# EAGLE design H0AR91 (EAGLE 9.6.2)

## Sheet 1 of 2
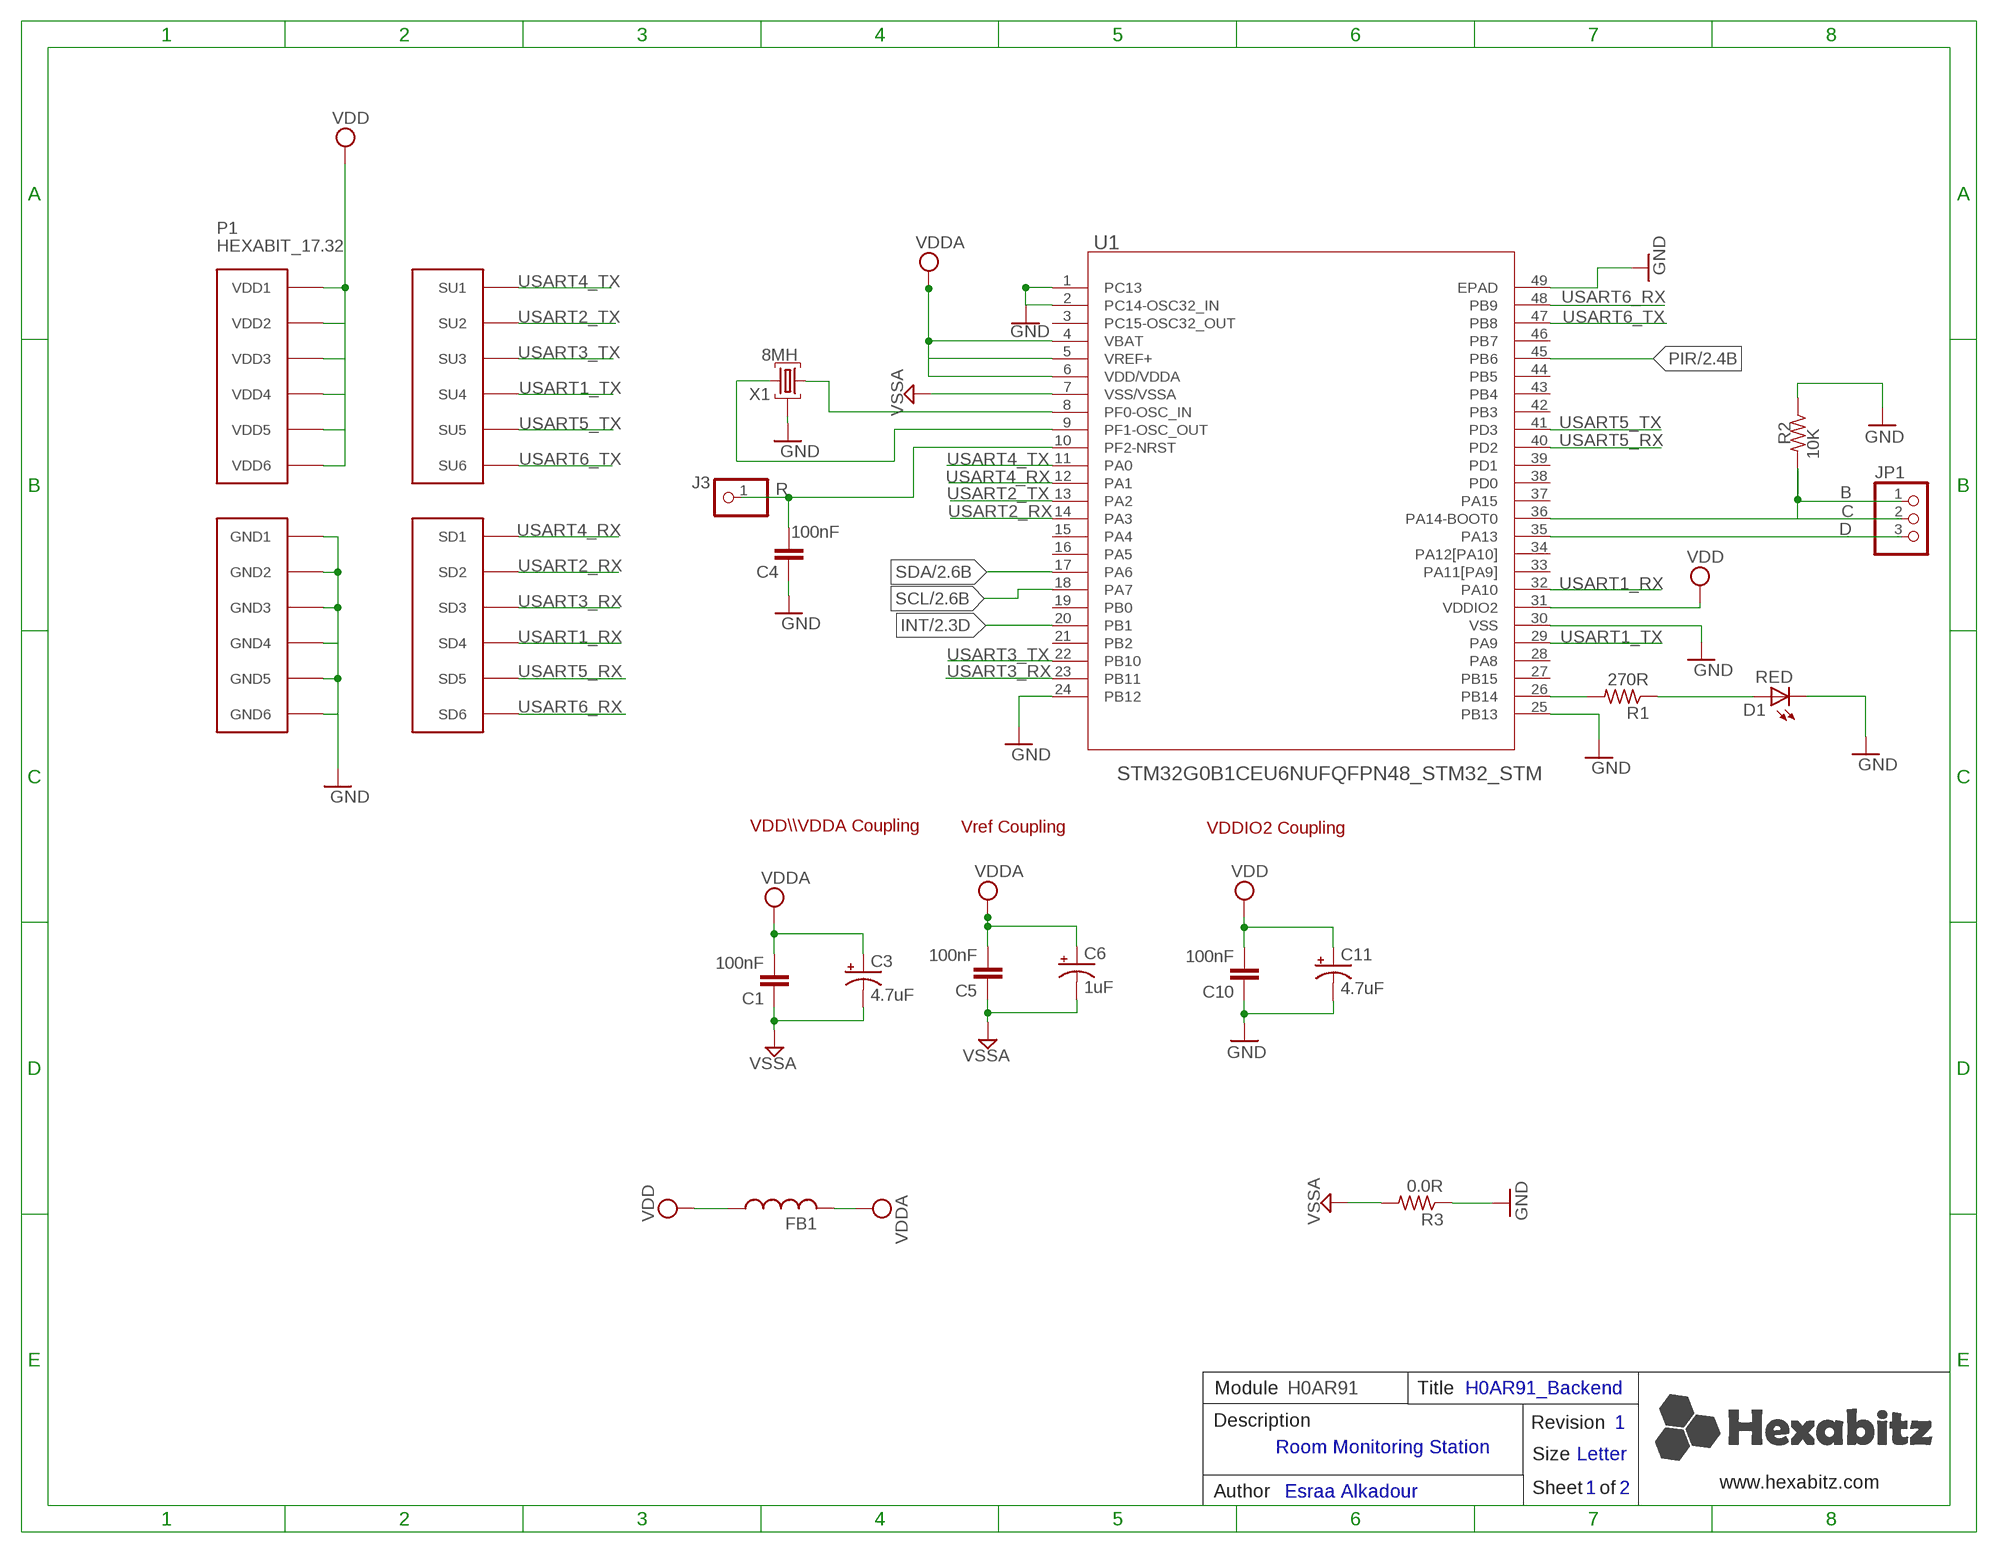
[diagram p0: schematic, sheet 1]

### Parts
C1  100nF  C-0603  [C-0603]
C3  4.7uF  C-0805-POL  [C-0805-POL]
C4  100nF  C-0603  [C-0603]
C5  100nF  C-0603  [C-0603]
C6  1uF  C-0805-POL  [C-0805-POL]
C10  100nF  C-0603  [C-0603]
C11  4.7uF  C-0805-POL  [C-0805-POL]
D1  RED  VLMS1300-GS08  [VLMS1300-GS08]
FB1  FB-TDK_MMZ1608Y300B  [FB-TDK_MMZ1608Y300B]
J3  PINHD-1X1  [1X01]
JP1  PINHD-1X3  [1X03]
P1  HEXABIT_17.32  [HEXABIT_17.32]
R1  270R  R-0603  [R-0603]
R2  10K  R-0603  [R-0603]
R3  0.0R  R-0603  [R-0603]
U1  STM32G0B1CEU6NUFQFPN48_STM32_STM  [UFQFPN48_STM32_STM]
X1  8MH  XTALL_CSTCE8M00G52  [XTALL_CSTCE8M00G52]

### Nets
C: JP1.1 JP1.2 R2.2 U1.36(PA14-BOOT0)
D: JP1.3 U1.35(PA13)
GND: C4.1 C10.1 C11.2(-) D1.C P1.PAD_PD7(GND1) P1.PAD_PD8(GND2) P1.PAD_PD9(GND3) P1.PAD_PD10(GND4) P1.PAD_PD11(GND5) P1.PAD_PD12(GND6) R2.1 R3.1 U1.1(PC13) U1.2(PC14-OSC32_IN) U1.24(PB12) U1.25(PB13) U1.30(VSS) U1.49(EPAD) X1.P$2 ; also sheet 2
GND1: C1.1 C3.2(-) C5.1 C6.2(-) R3.2 U1.7(VSS/VSSA) ; supply symbol labelled VSSA
INT: U1.20(PB1) ; also sheet 2
N$1: U1.8(PF0-OSC_IN) X1.P$3
N$2: U1.9(PF1-OSC_OUT) X1.P$1
N$17: R1.2 U1.26(PB14)
N$19: D1.A R1.1
PIR: U1.45(PB6) ; also sheet 2
R: C4.2 J3.1 U1.10(PF2-NRST)
SCL: U1.18(PA7) ; also sheet 2
SDA: U1.17(PA6) ; also sheet 2
USART1_RX: P1.PAD_PD4(SD4) U1.32(PA10)
USART1_TX: P1.PAD_PU4(SU4) U1.29(PA9)
USART2_RX: P1.PAD_PD2(SD2) U1.14(PA3)
USART2_TX: P1.PAD_PU2(SU2) U1.13(PA2)
USART3_RX: P1.PAD_PD3(SD3) U1.23(PB11)
USART3_TX: P1.PAD_PU3(SU3) U1.22(PB10)
USART4_RX: P1.PAD_PD1(SD1) U1.12(PA1)
USART4_TX: P1.PAD_PU1(SU1) U1.11(PA0)
USART5_RX: P1.PAD_PD5(SD5) U1.40(PD2)
USART5_TX: P1.PAD_PU5(SU5) U1.41(PD3)
USART6_RX: P1.PAD_PD6(SD6) U1.48(PB9)
USART6_TX: P1.PAD_PU6(SU6) U1.47(PB8)
VCC: C1.2 C3.1(+) C5.2 C6.1(+) FB1.2 U1.4(VBAT) U1.5(VREF+) U1.6(VDD/VDDA) ; supply symbol labelled VDDA
VDD: C10.2 C11.1(+) FB1.1 P1.PAD_PU7(VDD1) P1.PAD_PU8(VDD2) P1.PAD_PU9(VDD3) P1.PAD_PU10(VDD4) P1.PAD_PU11(VDD5) P1.PAD_PU12(VDD6) U1.31(VDDIO2) ; also sheet 2
Unconnected: U1.3(PC15-OSC32_OUT) U1.15(PA4) U1.16(PA5) U1.19(PB0) U1.21(PB2) U1.27(PB15) U1.28(PA8) U1.33(PA11[PA9]) U1.34(PA12[PA10]) U1.37(PA15) U1.38(PD0) U1.39(PD1) U1.42(PB3) U1.43(PB4) U1.44(PB5) U1.46(PB7)

### Notes on the sheet
- R | B
- VDD\\\VDDA Coupling | Vref Coupling | VDDIO2 Coupling
- Module | H0AR91 | Title | H0AR91_Backend
- Description | Revision | 1
- Room Monitoring Station
- Size | Letter
- www.hexabitz.com
- Author | Esraa Alkadour | Sheet   of | 1 | 2
- C:/Users/Admin/Desktop/logodraft.bmp

## Sheet 2 of 2
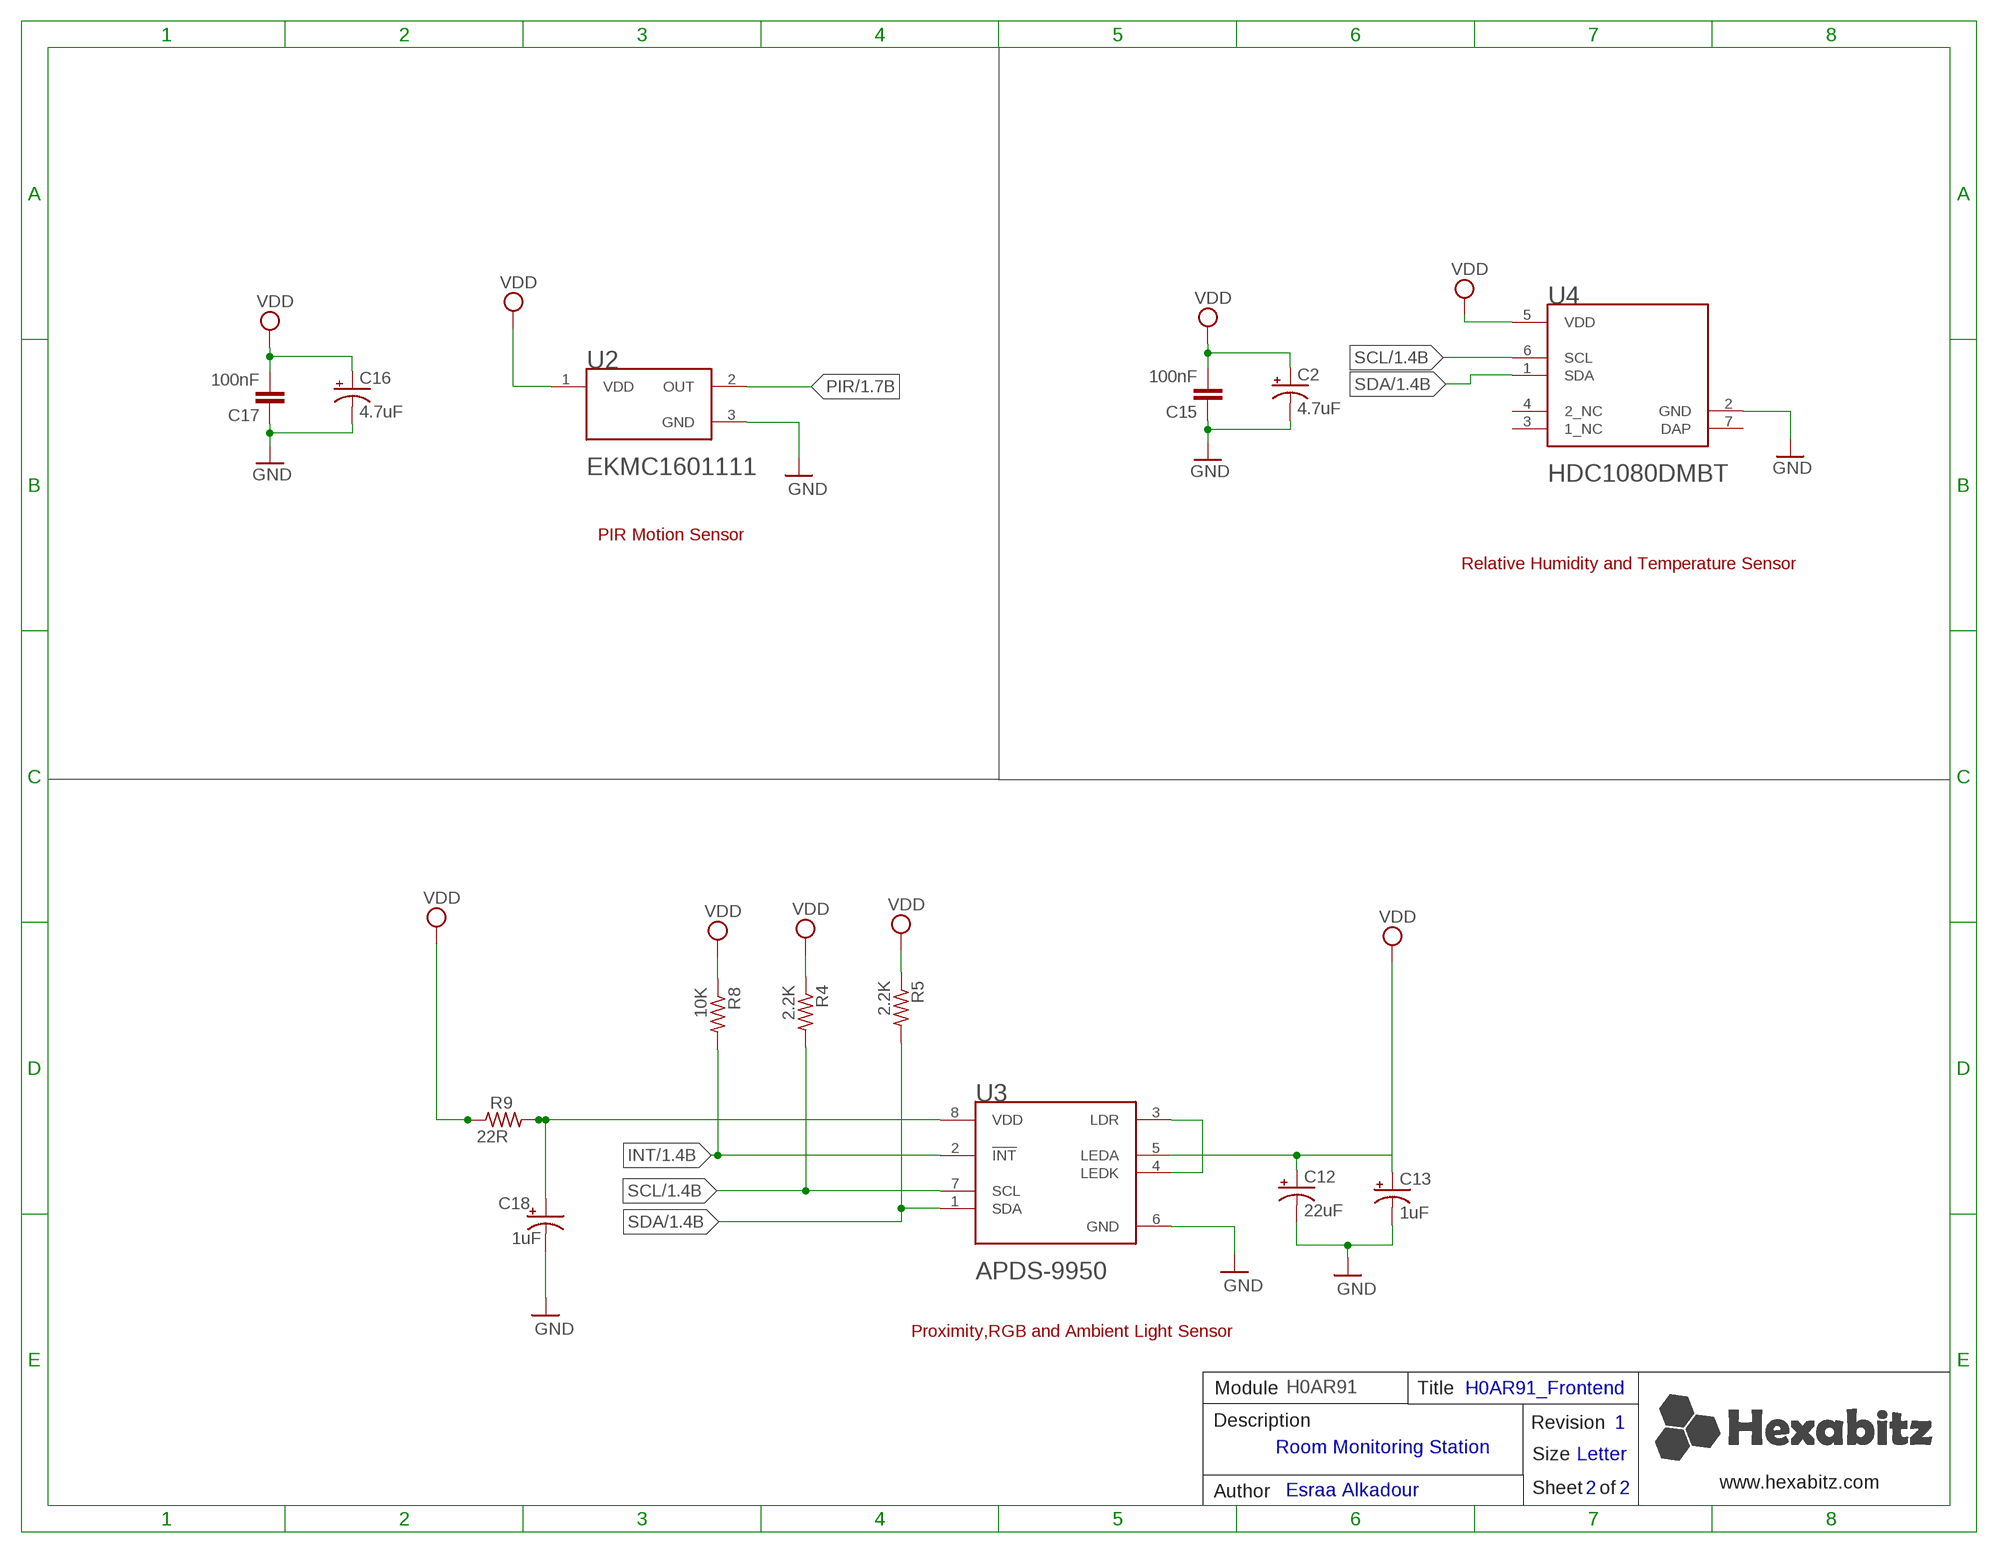
[diagram p1: schematic, sheet 2]

### Parts
C2  4.7uF  C-0805-POL  [C-0805-POL]
C12  22uF  C-0805-POL  [C-0805-POL]
C13  1uF  C-0805-POL  [C-0805-POL]
C15  100nF  C-0603  [C-0603]
C16  4.7uF  C-0805-POL  [C-0805-POL]
C17  100nF  C-0603  [C-0603]
C18  1uF  C-0805-POL  [C-0805-POL]
R4  2.2K  R-0603  [R-0603]
R5  2.2K  R-0603  [R-0603]
R8  10K  R-0603  [R-0603]
R9  22R  R-US_R1210  [R1210]
U2  PANASONIC_EKMC1601111PANASONIC_EKMC1601111_0_0  [PANASONIC_EKMC1601111_0]
U3  BROADCOM_APDS-9950BROADCOM_APDS-9950_0_0  BROADCOM_APDS-9960BROADCOM_APDS-9960_0_0  [BROADCOM_APDS-9960_0]
U4  TEXAS_INSTRUMENTS_HDC1080DMBT1TEXAS_INSTRUMENTS_HDC1080DMBT_0_1  [TEXAS_INSTRUMENTS_HDC1080DMBT_1]

### Nets
GND: C2.2(-) C12.2(-) C13.2(-) C15.1 C16.2(-) C17.1 C18.2(-) U2.3(GND) U3.6(GND) U4.2(GND) ; also sheet 1
INT: R8.2 U3.2(!INT!) ; also sheet 1
N$3: U3.3(LDR) U3.4(LEDK)
N$5: C18.1(+) R9.2 U3.8(VDD)
PIR: U2.2(OUT) ; also sheet 1
SCL: R4.2 U3.7(SCL) U4.6(SCL) ; also sheet 1
SDA: R5.2 U3.1(SDA) U4.1(SDA) ; also sheet 1
VDD: C2.1(+) C12.1(+) C13.1(+) C15.2 C16.1(+) C17.2 R4.1 R5.1 R8.1 R9.1 U2.1(VDD) U3.5(LEDA) U4.5(VDD) ; also sheet 1
Unconnected: U4.3(1_NC) U4.4(2_NC)

### Notes on the sheet
- PIR Motion Sensor
- Relative Humidity and Temperature Sensor
- Proximity,RGB and Ambient Light Sensor
- Module | H0AR91 | Title | H0AR91_Frontend
- Description | Revision | 1
- Room Monitoring Station
- Size | Letter
- www.hexabitz.com
- Author | Esraa Alkadour | Sheet   of | 2 | 2

## Power pins joined to a net without a drawn wire
DAP: U4.7(DAP)

## Library data of the parts
C1 C4 C5 C10 C15 C17 = HEXABITZ_RCLS:C-0603: CAP CER 10% X7R 0603; CAPACITANCE: 100nF; MFN: AVX CORPORATION; MPN: '0603YC104K4T2A; OCTOPART_URL: 'https://octopart.com/0603yc104k4t2a-avx+interconnect+%2F+elco-8120651; TOLERANCE: 10%; VOLTAGE_RATING: 16.0 V
C2 C3 C16 = HEXABITZ_RCLS:C-0805-POL: Cap Tant Solid SMD 2012; CAPACITANCE: 4.7uF; MFN: Panasonic; MPN: 10TPU4R7MSI; OCTOPART_URL: https://octopart.com/10tpu4r7msi-panasonic-29487748; TOLERANCE: 20%; VOLTAGE_RATING: 10.0 V
C6 C13 C18 = HEXABITZ_RCLS:C-0805-POL: Cap Tant Solid SMD 2012; CAPACITANCE: 1uF; MFN: 'YAGEO [VA]; MPN: 'CC0805KKX7R7BB105; OCTOPART_URL: https://octopart.com/cc0805kkx7r7bb105-yageo-8376555?r=sp; TOLERANCE: 20%; VOLTAGE_RATING: 10.0 V
C11 = HEXABITZ_RCLS:C-0805-POL: Cap Tant Solid SMD 2012; CAPACITANCE: 1.00uF; MFN: 'Panasonic; MPN: '10TPU4R7MSI; OCTOPART_URL: 'https://octopart.com/10tpu4r7msi-panasonic-29487748?r=sp; TOLERANCE: 10%; VOLTAGE_RATING: 16.0 V
C12 = HEXABITZ_RCLS:C-0805-POL: Cap Tant Solid SMD 2012; CAPACITANCE: 22uF; MFN: Kemet; MPN: T491B226K01AT; OCTOPART_URL: https://octopart.com/t491b226k016at-kemet-96457?r=sp; TOLERANCE: 20%; VOLTAGE_RATING: 10.0 V
D1 = HEXABITZ_USER_INTERFACE_PARTS:VLMS1300-GS08: Red 0603 130° Clear 54 mcd 2 V Surface Mount ChipLED ; Octopart Url : http://octopart.com/vlms1300-gs08-vishay-21709201; MFN: Vishay; MPN: VLMS1300-GS08; OCTOPART_URL: https://octopart.com/vlms1300-gs08-vishay-21709201?r=sp&s=0nXJNjGsSbWwqfqWlZv0EA
FB1 = HEXABITZ_RCLS:FB-TDK_MMZ1608Y300B: Ferrite Beads Multi-Layer 30Ohm 25% 100MHz 1.5A 50mOhm DCR 0603; MFN: TDK; MPN: MMZ1608Y300BTA00; OCTOPART_URL: https://octopart.com/mmz1608y300bta00-tdk-7906990?r=sp
J3 = HEXABITZ_USER_INTERFACE_PARTS:PINHD-1X1: PIN HEADER; MFN: TE Connectivity; MPN: 87227-1; OCTOPART_URL: https://octopart.com/87227-1-te+connectivity-39512052?r=sp
JP1 = pinhead:PINHD-1X3: PIN HEADER
P1 = hexabitz_connectors:HEXABIT_?: Hexabitz Hexagon Module Connector Hexagon side length = 28.87mm.
R1 = HEXABITZ_RCLS:R-0603: Thick Film Resistors - SMD 0603; MFN: 'Panasonic; MPN: 'ERJ-3GEYJ271V; OCTOPART_URL: https://octopart.com/erj-3geyj271v-panasonic-55560546?r=sp; RESISTANCE: 270R
R2 = HEXABITZ_RCLS:R-0603: Thick Film Resistors - SMD 0603; MFN: Vishay; MPN: '060300J0103T5E; OCTOPART_URL: https://octopart.com/search?q=060300J0103T5E&currency=USD&specs=0; RESISTANCE: 10K
R3 = HEXABITZ_RCLS:R-0603: Thick Film Resistors - SMD 0603; MFN: YAGEO [VR]; MPN: RC0603JR-070RL; OCTOPART_URL: https://octopart.com/rc0603jr-070rl-yageo-1241539?r=sp; RESISTANCE: 0R
R4 R5 = HEXABITZ_RCLS:R-0603: Thick Film Resistors - SMD 0603; MFN: Yageo; MPN: RC0603FR-072K2L; OCTOPART_URL: https://octopart.com/rc0603fr-072k2l-yageo-1214512?r=sp; RESISTANCE: 2.2K Ohm; TOLERANCE: 5%
R8 = HEXABITZ_RCLS:R-0603: Thick Film Resistors - SMD 0603; MFN: Vishay; MPN: '060300J0103T5E; OCTOPART_URL: https://octopart.com/search?q=060300J0103T5E&currency=USD&specs=0; RESISTANCE: 10K Ohm; TOLERANCE: 5%
R9 = rcl:R-US_: RESISTOR, American symbol; SPICEPREFIX: R
U1 = HEXABITZ_ICs:STM32G0B1CEU6N; COPYRIGHT: Copyright (C) 2022 Ultra Librarian. All rights reserved.; MFN: STMicroelectronics; MPN: STM32G0B1CEU6N; OCTOPART_URL: https://octopart.com/stm32g0b1ceu6n-stmicroelectronics-116364672?r=sp
U2 = HEXABITZ_ICs:PANASONIC_EKMC1601111: Board Mount Motion & Position Sensors Digital 170uA 5m White; CENTROID_NOT_SPECIFIED: No; DATASHEET: https://upverter.com/datasheet/08257041b259bfb866b24d8a71eb3fd58ddfaa35.pdf; DIGIKEY_DESCRIPTION: IC SENSOR MOTION PIR 170UA DGTL WHT; DIGIKEY_PART_NUMBER: 255-3074-ND; IMPORTED_FROM: octopart; LEAD_FREE: yes; MF: Panasonic; MOUSER_PART_NUMBER: 769-EKMC1601111; MPN: EKMC1601111; NUM_PINS: 3; OCTOPART_PART_NUMBER: 95495d6204bb4a8e; PACKAGE: PTH_SENSOR_11MM_DIA; PREFIX: U; ROHS: yes; SENSOR_TYPE: Motion, Pyroelectric, PIR (Passive Infrared); TEMPERATURE_RANGE_HIGH: +60 °C; TEMPERATURE_RANGE_LOW: -20 °C; VOLTAGE: 3 V ~ 6 V
U3 = HEXABITZ_ICs:BROADCOM_APDS-9960: Optical Sensor Ambient 560nm I²C 8-SMD Module; AMBIENT_TEMPERATURE_RANGE_HIGH: +85°C; AMBIENT_TEMPERATURE_RANGE_LOW: -30°C; AUTOMOTIVE: No; CENTROID_NOT_SPECIFIED: No; DATASHEET: http://docs.avagotech.com/docs/AV02-4191EN; DEVICE_CLASS_L1: Sensors; DEVICE_CLASS_L2: Optical Sensors; DEVICE_CLASS_L3: unset; DIGIKEY_DESCRIPTION: SENSOR OPT 560NM AMBIENT MODULE; DIGIKEY_PART_NUMBER: 516-3480-1-ND; FOOTPRINT_VARIANT_NAME_0: Recommended_Land_Pattern; HEIGHT: 1.45mm; LEAD_FREE: Yes; MAX_SUPPLY_VOLTAGE: 3.6V; MF: Broadcom; MFG_PACKAGE_IDENT: 0; MFG_PACKAGE_IDENT_DATE: 0; MFG_PACKAGE_IDENT_REV: 0; MIN_SUPPLY_VOLTAGE: 2.4V; MOUSER_PART_NUMBER: 630-APDS-9960; MPN: APDS-9960; OPERATING_SUPPLY_CURRENT: 38-790uA; PACKAGE: SMD8; PIN_0_0_5_INSIDE_EDGE: clock; PREFIX: U; ROHS: Yes; SENSOR_OUTPUT: I2C; TEMPERATURE_RANGE_HIGH: +85°C; TEMPERATURE_RANGE_LOW: -30°C; VERIFICATION_VERSION: 0.0.0.3
U4 = HEXABITZ_ICs:TEXAS_INSTRUMENTS_HDC1080DMBT1: HDC1080 Low Power, High Accuracy Digital Humidity Sensor with Temperature Sensor; ACCURACY: 2%; AMBIENT_TEMPERATURE_RANGE_HIGH: +70°C; AMBIENT_TEMPERATURE_RANGE_LOW: -20°C; AUTOMOTIVE: No; CENTROID_NOT_SPECIFIED: No; DATASHEET: https://www.ti.com/lit/ds/symlink/hdc1080.pdf?ts=1599702051529&ref_url=https%253A%252F%252Fwww.ti.com%252Fstore%252Fti%252Fen%252Fp%252Fproduct%252F%253Fp%253DHDC1080DMBT; DEVICE_CLASS_L1: Sensors; DEVICE_CLASS_L2: Temperature and Humidity Sensors; DEVICE_CLASS_L3: unset; DIGIKEY_DESCRIPTION: SENSOR HUMI/TEMP 3.3V I2C 2% SMD; DIGIKEY_PART_NUMBER: 296-43864-1-ND; FOOTPRINT_PARAMETERS_1: {"fp_type":"DFN","params":{"N":{"nom":6,"long name":"Number of leads","min":null,"max":null,"short name":"N","type":"count"},"A":{"nom":false,"long name":"Height","min":false,"max":800000,"short name":"A","type":"measurement"},"A1":{"nom":25000,"long name":"Package clearance","min":0,"max":50000,"short name":"A1","type":"measurement"},"A2":{"nom":false,"long name":"Package height","min":false,"max":800000,"short name":"A2","type":"measurement"},"D":{"nom":3000000,"long name":"Package length","min":2900000,"max":3100000,"short name":"D","type":"measurement"},"E":{"nom":3000000,"long name":"Package width","min":2900000,"max":3100000,"short name":"E","type":"measurement"},"B":{"nom":400000,"long name":"Lead width","min":350000,"max":450000,"short name":"B","type":"measurement"},"C":{"nom":200000,"long name":"Lead thickness","min":null,"max":null,"short name":"C","type":"measurement"},"L":{"nom":400000,"long name":"Lead foot length","min":300000,"max":500000,"short name":"L","type":"measurement"},"e":{"nom":1000000,"long name":"Lead pitch","min":null,"max":null,"short name":"e","type":"measurement"},"HT":{"default":"Yes","long name":"Thermal pad","type":"multichoiceparent","short name":"HT","children":["D2","E2","PC"]},"offset x":{"nom":0,"long name":"X Center offset","min":null,"max":null,"short name":"offset x","type":"measurement"},"offset y":{"nom":0,"long name":"Y Center offset","min":null,"max":null,"short name":"offset y","type":"measurement"},"LS":{"default":"Rounded rectangle","long name":"Land shape","type":"multichoice","short name":"LS"},"LS1":{"default":"Rectangle","long name":"Land shape (Pin 1)","type":"multichoice","short name":"LS1"},"solder toe":{"nom":400000,"long name":"Solder fillet (toe)","min":null,"max":null,"short name":"solder toe","type":"fixedmeasurement"},"solder heel":{"nom":0,"long name":"Solder fillet (heel)","min":null,"max":null,"short name":"solder heel","type":"fixedmeasurement"},"solder side":{"nom":-40000,"long name":"Solder fillet (side)","min":null,"max":null,"short name":"solder side","type":"fixedmeasurement"},"courtyard":{"nom":500000,"long name":"Courtyard","min":null,"max":null,"short name":"courtyard","type":"fixedmeasurement"},"SF":{"default":"A","long name":"Packing level","type":"multichoiceparent","short name":"SF","help":"http://support.upverter.com/customer/portal/articles/978783-what-is-a-footprint-packing-level","children":["solder toe","solder heel","solder side","courtyard"]},"D2":{"nom":2400000,"long name":"Thermal pad length","min":2300000,"max":2500000,"short name":"D2","type":"measurement"},"E2":{"nom":1500000,"long name":"Thermal pad width","min":1400000,"max":1600000,"short name":"E2","type":"measurement"},"PC":{"long name":"Paste coverage (%)","type":"percentage","short name":"PC","value":40}}}; FOOTPRINT_PARAMETERS_2: {"fp_type":"DFN","params":{"N":{"nom":6,"long name":"Number of leads","min":null,"max":null,"short name":"N","type":"count"},"A":{"nom":false,"long name":"Height","min":false,"max":800000,"short name":"A","type":"measurement"},"A1":{"nom":25000,"long name":"Package clearance","min":0,"max":50000,"short name":"A1","type":"measurement"},"A2":{"nom":false,"long name":"Package height","min":false,"max":800000,"short name":"A2","type":"measurement"},"D":{"nom":3000000,"long name":"Package length","min":2900000,"max":3100000,"short name":"D","type":"measurement"},"E":{"nom":3000000,"long name":"Package width","min":2900000,"max":3100000,"short name":"E","type":"measurement"},"B":{"nom":400000,"long name":"Lead width","min":350000,"max":450000,"short name":"B","type":"measurement"},"C":{"nom":200000,"long name":"Lead thickness","min":null,"max":null,"short name":"C","type":"measurement"},"L":{"nom":400000,"long name":"Lead foot length","min":300000,"max":500000,"short name":"L","type":"measurement"},"e":{"nom":1000000,"long name":"Lead pitch","min":null,"max":null,"short name":"e","type":"measurement"},"D2":{"nom":2400000,"long name":"Thermal pad length","min":2300000,"max":2500000,"short name":"D2","type":"measurement"},"E2":{"nom":1500000,"long name":"Thermal pad width","min":1400000,"max":1600000,"short name":"E2","type":"measurement"},"PC":{"long name":"Paste coverage (%)","type":"percentage","short name":"PC","value":40},"HT":{"default":"Yes","long name":"Thermal pad","type":"multichoiceparent","short name":"HT","children":["D2","E2","PC"]},"offset x":{"nom":0,"long name":"X Center offset","min":null,"max":null,"short name":"offset x","type":"measurement"},"offset y":{"nom":0,"long name":"Y Center offset","min":null,"max":null,"short name":"offset y","type":"measurement"},"LS":{"default":"Rounded rectangle","long name":"Land shape","type":"multichoice","short name":"LS"},"LS1":{"default":"Rectangle","long name":"Land shape (Pin 1)","type":"multichoice","short name":"LS1"},"solder toe":{"nom":300000,"long name":"Solder fillet (toe)","min":null,"max":null,"short name":"solder toe","type":"fixedmeasurement"},"solder heel":{"nom":0,"long name":"Solder fillet (heel)","min":null,"max":null,"short name":"solder heel","type":"fixedmeasurement"},"solder side":{"nom":-40000,"long name":"Solder fillet (side)","min":null,"max":null,"short name":"solder side","type":"fixedmeasurement"},"courtyard":{"nom":250000,"long name":"Courtyard","min":null,"max":null,"short name":"courtyard","type":"fixedmeasurement"},"SF":{"default":"B","long name":"Packing level","type":"multichoiceparent","short name":"SF","help":"http://support.upverter.com/customer/portal/articles/978783-what-is-a-footprint-packing-level","children":["solder toe","solder heel","solder side","courtyard"]}}}; FOOTPRINT_PARAMETERS_3: {"fp_type":"DFN","params":{"N":{"nom":6,"long name":"Number of leads","min":null,"max":null,"short name":"N","type":"count"},"A":{"nom":false,"long name":"Height","min":false,"max":800000,"short name":"A","type":"measurement"},"A1":{"nom":25000,"long name":"Package clearance","min":0,"max":50000,"short name":"A1","type":"measurement"},"A2":{"nom":false,"long name":"Package height","min":false,"max":800000,"short name":"A2","type":"measurement"},"D":{"nom":3000000,"long name":"Package length","min":2900000,"max":3100000,"short name":"D","type":"measurement"},"E":{"nom":3000000,"long name":"Package width","min":2900000,"max":3100000,"short name":"E","type":"measurement"},"B":{"nom":400000,"long name":"Lead width","min":350000,"max":450000,"short name":"B","type":"measurement"},"C":{"nom":200000,"long name":"Lead thickness","min":null,"max":null,"short name":"C","type":"measurement"},"L":{"nom":400000,"long name":"Lead foot length","min":300000,"max":500000,"short name":"L","type":"measurement"},"e":{"nom":1000000,"long name":"Lead pitch","min":null,"max":null,"short name":"e","type":"measurement"},"D2":{"nom":2400000,"long name":"Thermal pad length","min":2300000,"max":2500000,"short name":"D2","type":"measurement"},"E2":{"nom":1500000,"long name":"Thermal pad width","min":1400000,"max":1600000,"short name":"E2","type":"measurement"},"PC":{"long name":"Paste coverage (%)","type":"percentage","short name":"PC","value":40},"HT":{"default":"Yes","long name":"Thermal pad","type":"multichoiceparent","short name":"HT","children":["D2","E2","PC"]},"offset x":{"nom":0,"long name":"X Center offset","min":null,"max":null,"short name":"offset x","type":"measurement"},"offset y":{"nom":0,"long name":"Y Center offset","min":null,"max":null,"short name":"offset y","type":"measurement"},"LS":{"default":"Rounded rectangle","long name":"Land shape","type":"multichoice","short name":"LS"},"LS1":{"default":"Rectangle","long name":"Land shape (Pin 1)","type":"multichoice","short name":"LS1"},"solder toe":{"nom":200000,"long name":"Solder fillet (toe)","min":null,"max":null,"short name":"solder toe","type":"fixedmeasurement"},"solder heel":{"nom":0,"long name":"Solder fillet (heel)","min":null,"max":null,"short name":"solder heel","type":"fixedmeasurement"},"solder side":{"nom":-40000,"long name":"Solder fillet (side)","min":null,"max":null,"short name":"solder side","type":"fixedmeasurement"},"courtyard":{"nom":100000,"long name":"Courtyard","min":null,"max":null,"short name":"courtyard","type":"fixedmeasurement"},"SF":{"default":"C","long name":"Packing level","type":"multichoiceparent","short name":"SF","help":"http://support.upverter.com/customer/portal/articles/978783-what-is-a-footprint-packing-level","children":["solder toe","solder heel","solder side","courtyard"]}}}; FOOTPRINT_VARIANT_NAME_0: Recommended_Land_Pattern; FOOTPRINT_VARIANT_NAME_1: IPC_A; FOOTPRINT_VARIANT_NAME_2: IPC_B; FOOTPRINT_VARIANT_NAME_3: IPC_C; HEIGHT: 0.8mm; INTERFACE: I2C; LEAD_FREE: Yes; MAX_SUPPLY_VOLTAGE: 5.5V; MF: Texas Instruments; MFG_PACKAGE_IDENT: DMB0006A; MFG_PACKAGE_IDENT_COMPONENT_ID: ec7dcad3e24eabe8; MFG_PACKAGE_IDENT_DATE: 0; MFG_PACKAGE_IDENT_REV: 0; MIN_SUPPLY_VOLTAGE: 2.7V; MOUSER_PART_NUMBER: 595-HDC1080DMBT; MPN: HDC1080DMBT; PACKAGE: WSON6; PIN_0_0_2_INSIDE_EDGE: clock; PREFIX: U; RESOLUTION: 14bits; ROHS: Yes; SENSOR_OUTPUT: I2C; STANDOFF_HEIGHT: 0mm; TEMPERATURE_RANGE_HIGH: +85°C; TEMPERATURE_RANGE_LOW: -20°C; VERIFICATION_VERSION: 0.0.0.3; VOLTAGE: 5.5V
X1 = HEXABITZ_OTHER_PARTS:XTALL_CSTCE8M00G52: MURATA CSTCE8M00G52-R0 RESONATOR, SMD, 8MHZ ; Octopart Url : https://octopart.com/cstce8m00g52-r0-murata-7145559; MFN: Murata; MPN: CSTNE8M00G550000R0; OCTOPART_URL: https://octopart.com/cstne8m00g550000r0-murata-91406934?r=sp

## Board
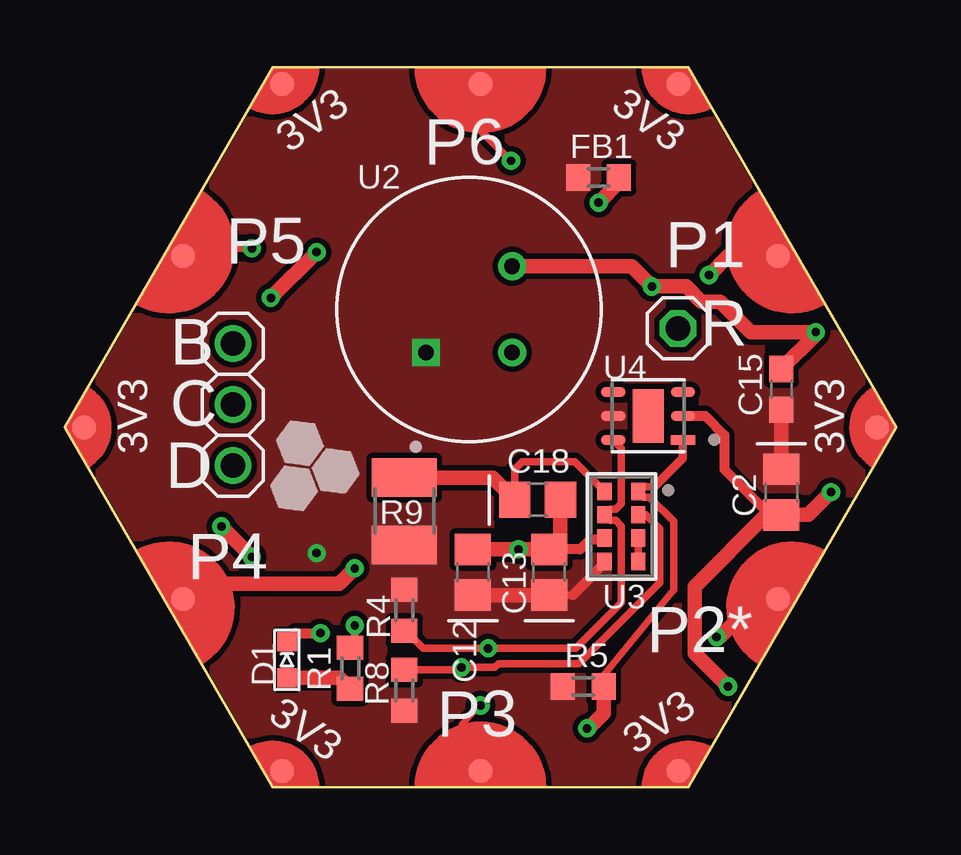
[diagram p2: board, top side]
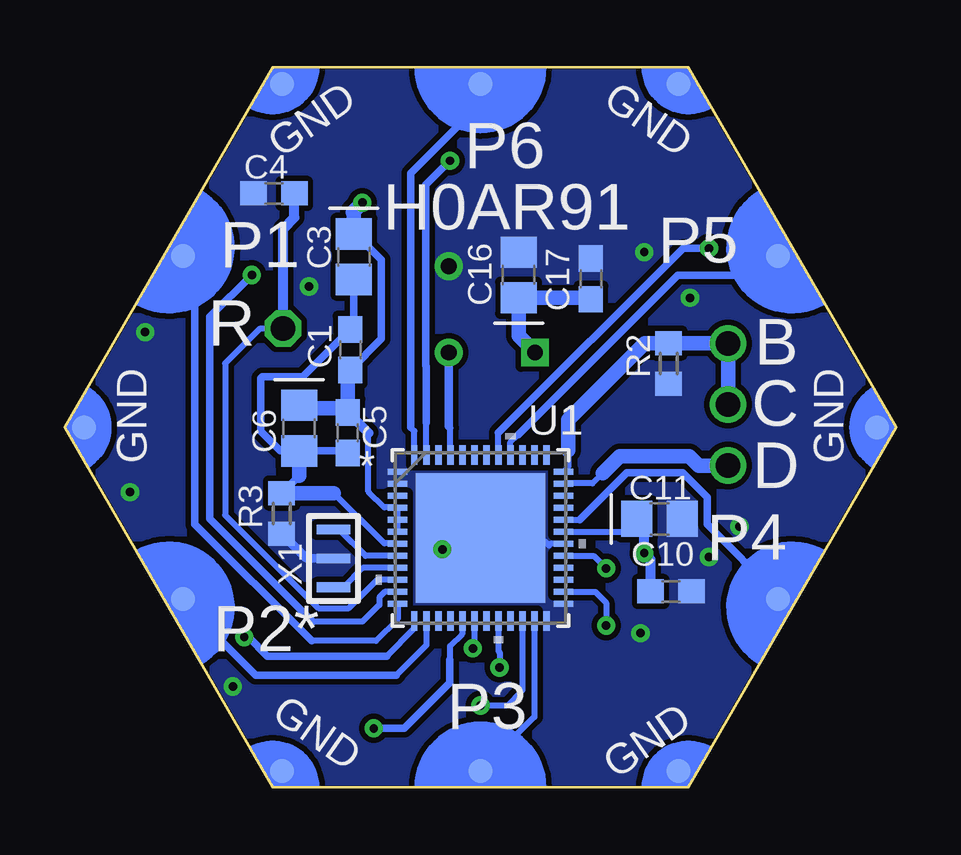
[diagram p3: board, bottom side, seen from below]

Size 34.64 x 30 mm. Coordinates in mm from the lower left corner, seen from the top.
Copper layers (1*16): Top 0.035mm / dielectric 1.5mm / Bottom 0.035mm
Design rules "2_layer *": minimum track width 7mil, minimum drill 10mil, track to track 9mil, track to pad 9mil, pad to pad 9mil, via to via 9mil, smd to smd 0mil, copper to edge 1mil, drill to drill 8mil, minimum pad ring 10mil, minimum via ring 8mil, stop-mask expansion 2mil, vias tented up to drill 15mil, thermal gap 10mil

### Footprints (pad centres in the part's own frame; a part is rotated, then mirrored left to right if it is on the bottom)
C-0603 = smd 1.1 x 1: 1 -0.85,0; 2 0.85,0
C-0805-POL = smd 1.3 x 1.5: 1 -0.95,0; 2 0.95,0
VLMS1300-GS08 = smd 0.8 x 0.8: A 0,0.75; C 0,-0.75
FB-TDK_MMZ1608Y300B = smd 1 x 1.1: 1 -0.85,0; 2 0.85,0
1X01 = drill 1.016 octagon: 1 0,0
1X03 = drill 1.016: 1 -2.54,0; 2 0,0; 3 2.54,0
HEXABIT_17.32 = smd 1 x 1 bottom: PAD_PD1 12.39,7.15; PAD_PD2 12.39,-7.15; PAD_PD3 0,-14.31; PAD_PD4 -12.39,-7.15; PAD_PD5 -12.39,7.15; PAD_PD6 0,14.31; PAD_PD7 8.26,14.31; PAD_PD8 16.52,0; PAD_PD9 8.26,-14.31; PAD_PD10 -8.26,-14.31; PAD_PD11 -16.52,0; PAD_PD12 -8.26,14.31 | smd 1 x 1: PAD_PU1 12.39,7.15; PAD_PU2 12.39,-7.15; PAD_PU3 0,-14.31; PAD_PU4 -12.39,-7.15; PAD_PU5 -12.39,7.15; PAD_PU6 0,14.31; PAD_PU7 8.26,14.31; PAD_PU8 16.52,0; PAD_PU9 8.26,-14.31; PAD_PU10 -8.26,-14.31; PAD_PU11 -16.52,0; PAD_PU12 -8.26,14.31
R-0603 = smd 1 x 1.1: 1 -0.85,0; 2 0.85,0
R1210 = smd 1.6 x 2.7: 1 -1.4,0; 2 1.4,0
UFQFPN48_STM32_STM = smd 0.813 x 0.254: 1 -3.454,2.751; 2 -3.454,2.251; 3 -3.454,1.75; 4 -3.454,1.25; 5 -3.454,0.75; 6 -3.454,0.25; 7 -3.454,-0.25; 8 -3.454,-0.75; 9 -3.454,-1.25; 10 -3.454,-1.75; 11 -3.454,-2.251; 12 -3.454,-2.751; 25 3.454,-2.751; 26 3.454,-2.251; 27 3.454,-1.75; 28 3.454,-1.25; 29 3.454,-0.75; 30 3.454,-0.25; 31 3.454,0.25; 32 3.454,0.75; 33 3.454,1.25; 34 3.454,1.75; 35 3.454,2.251; 36 3.454,2.751 | smd 0.254 x 0.813: 13 -2.751,-3.454; 14 -2.251,-3.454; 15 -1.75,-3.454; 16 -1.25,-3.454; 17 -0.75,-3.454; 18 -0.25,-3.454; 19 0.25,-3.454; 20 0.75,-3.454; 21 1.25,-3.454; 22 1.75,-3.454; 23 2.251,-3.454; 24 2.751,-3.454; 37 2.751,3.454; 38 2.251,3.454; 39 1.75,3.454; 40 1.25,3.454; 41 0.75,3.454; 42 0.25,3.454; 43 -0.25,3.454; 44 -0.75,3.454; 45 -1.25,3.454; 46 -1.75,3.454; 47 -2.251,3.454; 48 -2.751,3.454 | smd 5.385 x 5.385: 49 0,0
PANASONIC_EKMC1601111_0 = drill 0.65 pad 1.15 square: 1 -1.796,1.796 | drill 0.65 pad 1.15: 2 -1.796,-1.796; 3 1.796,-1.796
BROADCOM_APDS-9960_0 = smd 0.6 x 0.72: 1 0.7,1.455; 2 0.7,0.485; 3 0.7,-0.485; 4 0.7,-1.455; 5 -0.7,-1.455; 6 -0.7,-0.485; 7 -0.7,0.485; 8 -0.7,1.455
TEXAS_INSTRUMENTS_HDC1080DMBT_1 = smd 1.01 x 0.392: 1 -1.451,1; 2 -1.451,0; 3 -1.451,-1; 4 1.451,-1; 5 1.451,0; 6 1.451,1 | smd 1.295 x 2.246: 7 0,0
XTALL_CSTCE8M00G52 = smd 1.4 x 0.4: P$1 0,1.2; P$2 0,0; P$3 0,-1.2

### Placement (x,y rotation side)
C1  22.75,18.24 270 bottom
C2  29.86,12.3 270 top
C3  22.59,22.11 270 bottom
C4  25.92,24.75 0 bottom
C5  22.84,14.78 90 bottom
C6  24.88,14.97 270 bottom
C10  9.38,8.17 180 bottom
C11  9.86,11.19 0 bottom
C12  17,8.97 90 top
C13  20.18,8.97 90 top
C15  29.86,16.59 270 top
C16  15.73,21.35 90 bottom
C17  12.72,21.19 270 bottom
C18  19.7,11.98 0 top
D1  9.26,5.32 180 top
FB1  22.24,25.41 0 top
J3  25.54,19.13 0 top
JP1  7,15.95 270 top
P1  17.32,15 0 top
R1  11.89,4.97 90 top
R2  9.48,17.67 90 bottom
R3  25.61,11.41 90 bottom
R4  14.14,7.38 270 top
R5  21.61,4.2 0 top
R8  14.14,4.05 90 top
R9  14.14,11.51 90 top
U1  17.32,10.4 0 bottom
U2  16.84,19.92 90 top
U3  23.19,10.87 0 top
U4  24.3,15.48 180 top
X1  23.45,9.54 180 bottom

### Tracks (layer width: path | path; a pad name or v marks a point on that pad's centre or on a via)
C
  Bottom 0.254: 13.67,14.05 13.67,13.34 U1.36
  Bottom 0.61: JP1.2 JP1.1 7.03,18.52 R2.2 10.47,18.52 13.67,15.32 13.67,14.05
D
  Bottom 0.254: U1.35 13.85,12.66 12.65,12.66 12.23,13.09
  Bottom 0.61: JP1.3 8.22,13.41 8.61,13.8 11.52,13.8 12.23,13.09
GND  (via drill 0.35)
  Top 0.305: U3.6 22.42,10.32 | C13.2 20.49,9.92 20.65,10.07
  Top 0.406: 22.42,10.32 21.88,10.32 21.48,9.92 20.49,9.92 | D1.C 9.62,6.43 v10.65,6.43 | U4.2 26.69,15.48 27.48,14.68 27.48,13.25 29.38,11.35 C2.2
  Top 0.61: v27.64,4.2 26.24,5.6 26.24,8.37 29.23,11.35 C2.2 30.98,11.35 v31.92,12.3 | v8.59,20.4 v10.49,22.3 | v7.79,9.6 v6.52,10.87 | C18.2 20.65,10.07 | C12.2 v18.91,9.92 C13.2 | C15.1 31.29,18.87 v31.29,18.97 28.59,18.97 27.32,20.24 26.53,20.24 25.89,20.87 v24.46,20.87 23.62,21.72 U2.3
  Bottom 0.254: U1.30 14.4,10.15 14.47,10.08 14.62,10.24
  Bottom 0.356: X1.P$2 24.58,9.54 R3.1
  pour Bottom (no thermals): 8.5,29.92 25.89,29.92 34.62,15 26.05,0.08 8.68,-0.08 -0.06,15.02
GND1
  Bottom 0.254: U1.7 20.79,10.16 21.33,10.16 23.41,12.24
  Bottom 0.305: 23.41,12.24 23.43,12.26 | R3.2 24.88,12.99 | C5.1 22.93,14.02 C6.2 25.67,14.02 26.48,14.83 26.48,17.04 26.42,17.11 24.73,17.11 C1.1 22.59,19.25 C3.2
  Bottom 0.61: 23.43,12.26 R3.2 | C6.2 24.88,12.99
INT  (via drill 0.35)
  Top 0.305: R8.2 16.42,4.9 v16.53,5 17.92,5 18.08,5.16 21.41,5.16 24.78,8.53 24.78,10.79 24.21,11.36 U3.2
  Bottom 0.254: U1.20 16.57,5.68 16.53,5.63 v16.53,5
N$1
  Bottom 0.254: X1.P$3 23.2,10.74 22.1,9.65 U1.8
N$2
  Bottom 0.254: X1.P$1 22.97,8.34 23,8.37 22.22,9.15 U1.9
N$3
  Top 0.305: U3.3 U3.4
N$5
  Top 0.305: U3.8 21.25,13.57 19.07,13.57 18.75,13.26 C18.1
  Top 0.61: R9.2 17.83,12.91 C18.1
N$17  (via drill 0.35)
  Top 0.305: v12.08,6.74 12.08,6.01 R1.2
  Bottom 0.254: U1.26 12.53,8.15 12.08,7.7 v12.08,6.74
N$19
  Top 0.61: D1.A 11.44,4.57 R1.1
PIR
  Bottom 0.254: U1.45 18.57,14.98 18.64,15.05
  Bottom 0.356: 18.64,15.05 U2.2
R
  Bottom 0.254: J3.1 26.5,19.13 27.96,17.67 27.96,11.35 24.07,7.47 22.81,7.47 21.63,8.65 U1.10
  Bottom 0.406: J3.1 25.54,23.29 25.07,23.76 C4.2
SCL  (via drill 0.35)
  Top 0.305: U4.6 23.19,14.14 23.19,11.82 22.95,11.59 22.72,11.59 U3.7 22.72,11.13 22.95,11.13 23.19,10.89 23.19,7.7 21.29,5.79 v17.64,5.79 14.94,5.79 14.2,6.53 R4.2
  Bottom 0.254: v17.64,5.79 17.57,5.72 U1.18
SDA  (via drill 0.35)
  Top 0.305: 24.56,12.52 24.09,12.52 U3.1 24.12,12.1 24.35,12.1 25.37,11.08 25.37,8.23 22.46,4.68 R5.2 | v21.77,2.46 21.77,2.4
  Top 0.356: U4.1 25.76,13.71 24.56,12.52
  Top 0.61: R5.2 22.46,3.09 21.77,2.4
  Bottom 0.254: U1.17 18.09,6.92 18.09,6.39 18.59,5.89 18.59,5.32
  Bottom 0.305: 18.59,5.32 18.59,4.36 20.49,2.46 v21.77,2.46
USART1_RX
  Bottom 0.254: U1.32 13.2,11.15 13.19,11.15
  Bottom 0.305: 13.19,11.15 11.23,13.11 8.89,13.11 7.88,12.1 7.88,10.96 4.93,8.01 P1.PAD_PD4
USART1_TX  (via drill 0.35)
  Top 0.305: P1.PAD_PU4 5.88,7.85 6.52,8.49
  Top 0.61: v12.08,9.13 11.45,8.49 6.52,8.49
  Bottom 0.254: v12.08,9.13 12.6,9.65 U1.29
USART2_RX
  Bottom 0.254: 29.71,7.7 P1.PAD_PD2 | U1.14 19.57,5.93 20.82,4.68
  Bottom 0.305: 20.82,4.68 26.69,4.68 29.71,7.7
USART2_TX  (via drill 0.35)
  Top 0.305: 27.32,6.27 v27.16,6.27 | 28.9,7.85 P1.PAD_PU2
  Top 0.61: 28.9,7.85 27.32,6.27
  Bottom 0.254: U1.13 20.07,6.62 21.23,5.47
  Bottom 0.305: v27.16,6.27 27,6.27 26.2,5.47 21.23,5.47
USART3_RX
  Bottom 0.254: U1.23 15.07,2.94 P1.PAD_PD3
USART3_TX  (via drill 0.35)
  Top 0.254: v17.32,3.41 16.53,2.62 16.53,1.48 P1.PAD_PU3
  Bottom 0.254: U1.22 15.57,4.05 16.21,3.41 v17.32,3.41
USART4_RX
  Bottom 0.254: 29.22,21.66 P1.PAD_PD1 | 24.35,6.11 21.67,6.11 20.77,7.01 U1.12
  Bottom 0.305: 24.35,6.11 29.22,10.97 29.22,21.66
USART4_TX  (via drill 0.35)
  Top 0.305: 27.64,22.15 P1.PAD_PU1
  Top 0.61: 27.64,22.15 v26.85,21.35
  Bottom 0.254: 24.31,6.9 22.24,6.9 21.54,7.61 21.54,7.92 21.31,8.15 U1.11
  Bottom 0.305: 24.31,6.9 28.59,11.19 28.59,19.6 v26.85,21.35
USART5_RX
  Bottom 0.254: 4.78,21.35 4.78,22 P1.PAD_PD5 | U1.40 16.07,14.39 15.75,14.7
  Bottom 0.305: 4.78,21.35 9.11,21.35 15.75,14.7
USART5_TX  (via drill 0.35)
  Top 0.305: v7.79,22.46 5.24,22.46 P1.PAD_PU5
  Bottom 0.254: U1.41 16.57,14.77
  Bottom 0.305: v7.79,22.46 8.88,22.46 16.57,14.77
USART6_RX
  Bottom 0.254: U1.48 20.07,14.84 20.23,15
  Bottom 0.305: 20.23,15 20.23,25.58 17.16,28.65 17.16,29.15 P1.PAD_PD6
USART6_TX  (via drill 0.35)
  Top 0.305: v18.59,26.11 17.32,27.38 P1.PAD_PU6
  Bottom 0.254: U1.47 19.59,13.87 19.59,15.2
  Bottom 0.305: 19.59,15.2 19.59,17.56 19.6,17.57 19.6,25.1 v18.59,26.11
VCC  (via drill 0.35)
  Top 0.61: FB1.2 23.09,25.22 v22.24,24.37
  Bottom 0.178: C6.1 24.99,15.81
  Bottom 0.254: U1.6 U1.5 U1.4 20.79,11.66 21.33,11.66 21.99,12.32 21.99,14.77
  Bottom 0.305: C3.1 22.52,23.06 21.45,21.98 21.45,18.69 C1.2 22.84,17.29
  Bottom 0.406: 21.99,14.77 C5.2
  Bottom 0.61: 24.99,15.81 23.03,15.81 C5.2 22.84,17.29 | v22.24,24.37 22.64,23.97 22.59,23.92 C3.1
VDD  (via drill 0.35)
  Top 0.305: C13.1 21.17,8.02 | U3.5 22.57,9.42
  Top 0.406: 22.57,9.42 21.17,8.02
  Top 0.61: C13.1 C12.1 | C15.2 C2.1
  Bottom 0.254: U1.31 10.88,10.65 10.81,10.71
  Bottom 0.305: 10.81,10.71 C11.1 10.81,11.67 | v10.49,9.76
  Bottom 0.406: C10.2 10.23,9.5 v10.49,9.76 | v10.49,9.76 10.49,10.87 C11.1
  Bottom 0.61: C17.2 12.77,20.4 C16.1 15.73,18.81 U2.1
  pour Top (no thermals): 8.5,29.92 25.89,29.92 34.62,15 25.89,0.08 8.52,0.08 -0.14,14.88

### Text on the board
tPlace: 3V3 | 3V3 | P6 | P5 | P1 | 3V3 | 3V3 | P4 | P2* | 3V3 | P3 | 3V3
bPlace: GND | GND | P6 | H0AR91 | P5 | P1 | GND | GND | P4 | P2* | P3 | GND | GND
tNames: R | B | C | D
bNames: R | B | C | D